# EAGLE design working (EAGLE 9.3.0)
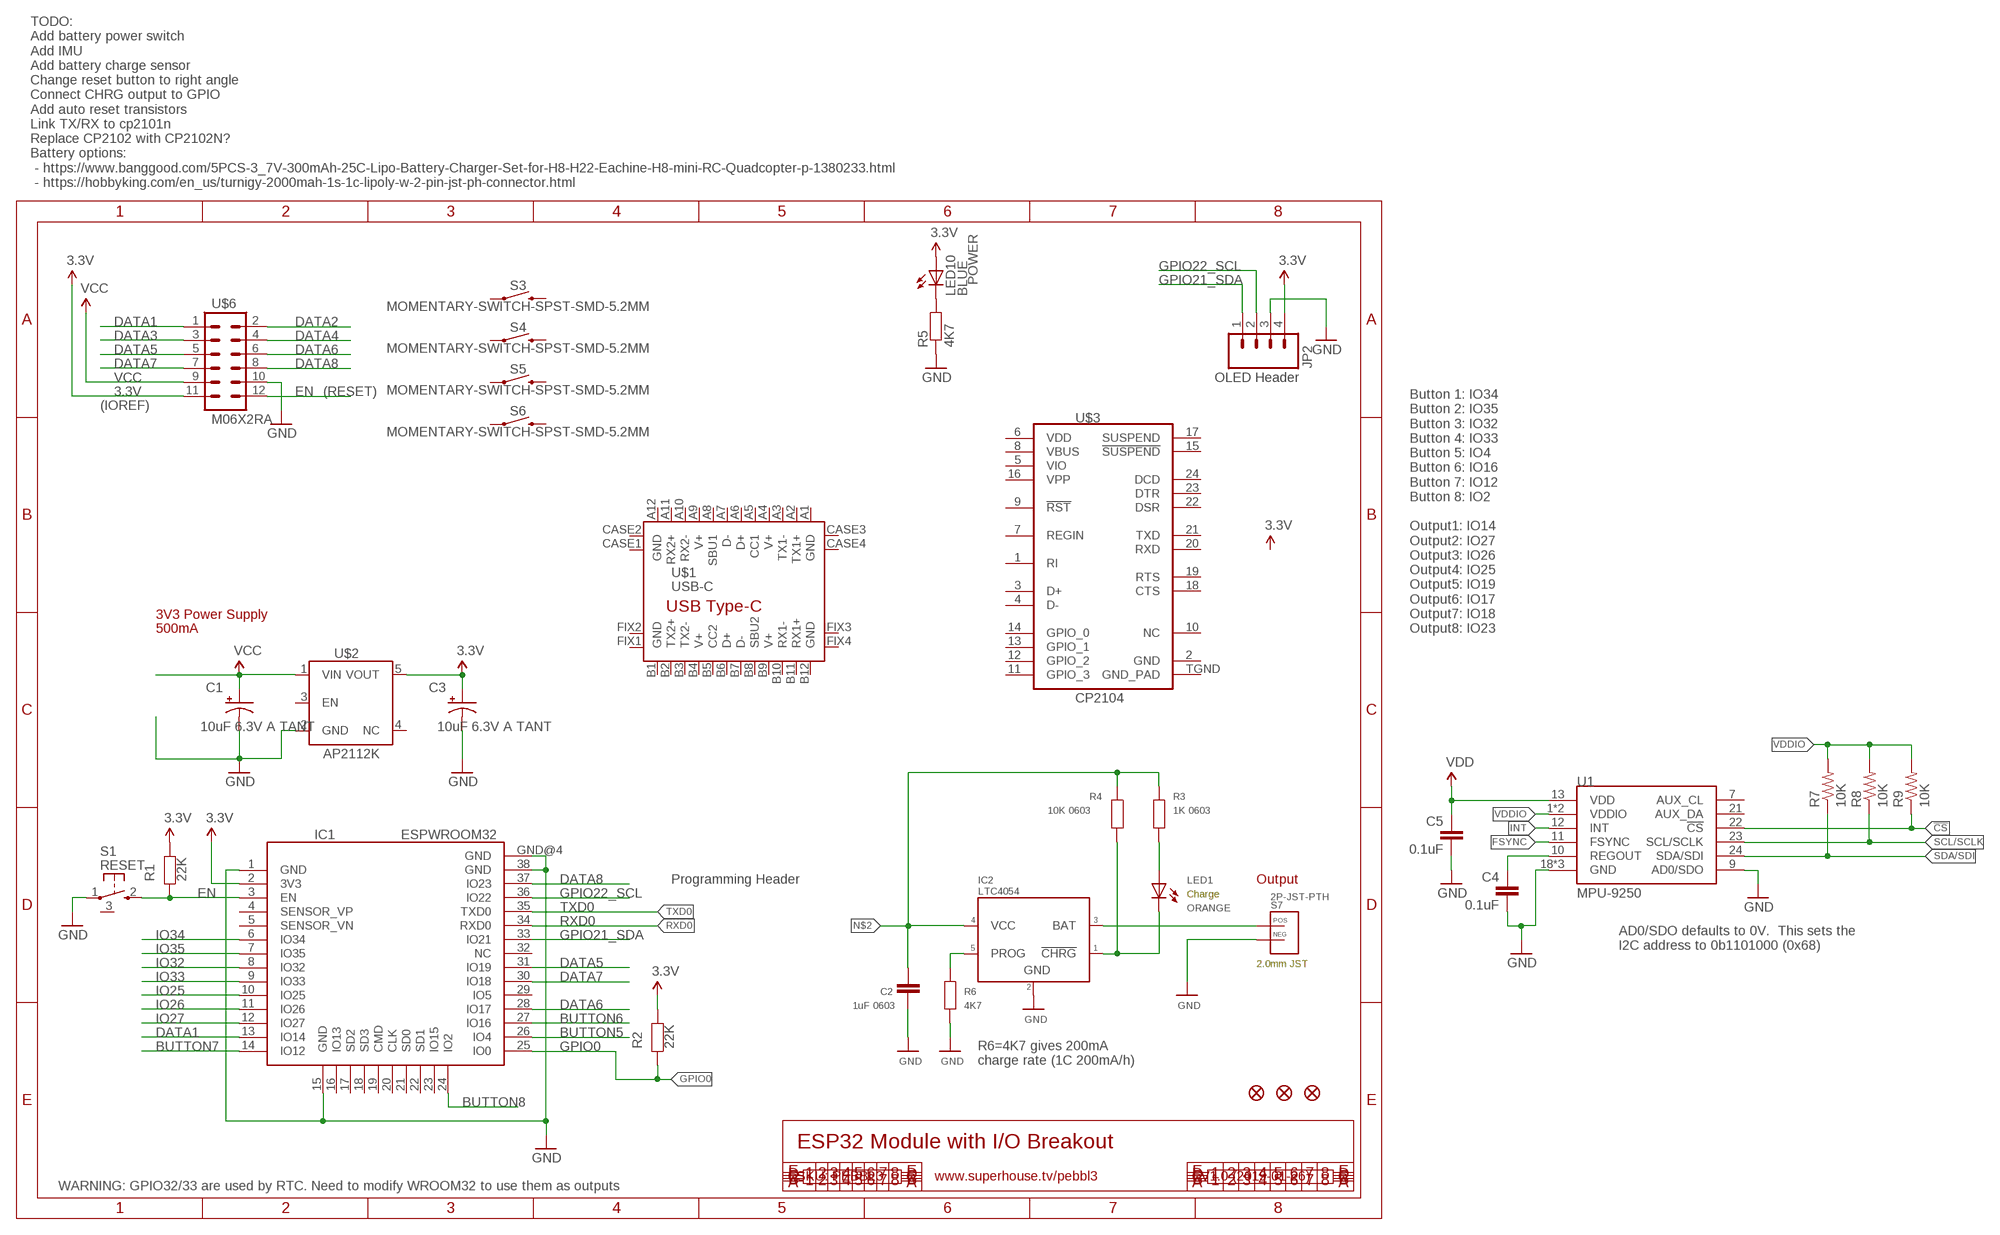
[diagram p0: schematic, sheet 1]

## Parts
C1  10uF 6.3V A TANT  CAP_POL1206  [EIA3216]
C2  1uF 0603  CAP0603  [0603]
C3  10uF 6.3V A TANT  CAP_POL1206  [EIA3216]
C4  0.1uF  0.1UF-25V(+80/-20%)(0603)  [0603-CAP]
C5  0.1uF  0.1UF-25V(+80/-20%)(0603)  [0603-CAP]
FID1  FIDUCIAL1X2.5  [FIDUCIAL-1X2.5]
FID2  FIDUCIAL1X2.5  [FIDUCIAL-1X2.5]
FID3  FIDUCIAL1X2.5  [FIDUCIAL-1X2.5]
IC1  ESPWROOM32  [ESPWROOM32]
IC2  LTC4054  [SOT23-5]
JP2  M04PTH  [1X04]
LED1  ORANGE  LED0603  [LED-0603]
LED10  BLUE  LED0603  [LED-0603]
R1  22K  RESISTOR0603  [0603]
R2  22K  RESISTOR0603  [0603]
R3  1K 0603  RESISTOR0603  [0603]
R4  10K 0603  RESISTOR0603  [0603]
R5  4K7  RESISTOR0603  [0603]
R6  4K7  RESISTOR0603  [0603]
R7  10K  10KOHM-1/10W-1%(0603)0603  [0603-RES]
R8  10K  10KOHM-1/10W-1%(0603)0603  [0603-RES]
R9  10K  10KOHM-1/10W-1%(0603)0603  [0603-RES]
S1  RESET  TAC-SWITCH-1TAB  [TACT-VERT-1TAB]
S3  MOMENTARY-SWITCH-SPST-SMD-5.2MM  [TACTILE_SWITCH_SMD_5.2MM]
S4  MOMENTARY-SWITCH-SPST-SMD-5.2MM  [TACTILE_SWITCH_SMD_5.2MM]
S5  MOMENTARY-SWITCH-SPST-SMD-5.2MM  [TACTILE_SWITCH_SMD_5.2MM]
S6  MOMENTARY-SWITCH-SPST-SMD-5.2MM  [TACTILE_SWITCH_SMD_5.2MM]
S7  2P-JST-PTH  2P-JST-TH-RAPTH  [JST-2MM-TH-RA]
U1  MPU-9250  [QFN24_PAD]
U$1  USB-C  [USB-C-U52A]
U$2  AP2112KSOT25  [SOT23-5]
U$3  CP2104  [QFN-24]
U$6  M06X2RA  [2X6-SHROUDED-RA]

## Nets
3.3V: C3.A(+) IC1.2(3V3) JP2.4 LED10.A R1.1 R2.1 U$2.5(VOUT) U$6.11
!CS: R9.1 U1.22(!CS)
BUTTON5: IC1.26(IO4)
BUTTON6: IC1.27(IO16)
BUTTON7: IC1.14(IO12)
BUTTON8: IC1.24(IO2)
DATA1: IC1.13(IO14) U$6.1
DATA2: U$6.2
DATA3: U$6.3
DATA4: U$6.4
DATA5: IC1.31(IO19) U$6.5
DATA6: IC1.28(IO17) U$6.6
DATA7: IC1.30(IO18) U$6.7
DATA8: IC1.37(IO23) U$6.8
EN: IC1.3(EN) R1.2 S1.2 U$6.12
FSYNC: U1.11(FSYNC)
GND: C1.C(-) C2.1 C3.C(-) C4.2 C5.2 IC1.1(GND) IC1.15(GND) IC1.38(GND) IC1.GND@4(GND) IC2.2(GND) JP2.3 R5.1 R6.2 S1.1 S7.NEG U1.9(AD0/SDO) U1.18(GND) U1.20(GND) U1.CENTER(GND) U$2.2(GND) U$6.10
GPIO0: IC1.25(IO0) R2.2
GPIO21_SDA: IC1.33(IO21) JP2.1
GPIO22_SCL: IC1.36(IO22) JP2.2
INT: U1.12(INT)
IO25: IC1.10(IO25)
IO26: IC1.11(IO26)
IO27: IC1.12(IO27)
IO32: IC1.8(IO32)
IO33: IC1.9(IO33)
IO34: IC1.6(IO34)
IO35: IC1.7(IO35)
N$2: C2.2 IC2.4(VCC) R3.1 R4.1
N$3: IC2.5(PROG) R6.1
N$4: IC2.3(BAT) S7.POS
N$6: IC2.1(!CHRG) LED1.C R4.2
N$8: LED1.A R3.2
N$14: LED10.C R5.2
REGOUT: C4.1 U1.10(REGOUT)
RXD0: IC1.34(RXD0)
SCL/SCLK: R8.1 U1.23(SCL/SCLK)
SDA/SDI: R7.1 U1.24(SDA/SDI)
TXD0: IC1.35(TXD0)
VCC: C1.A(+) U$2.1(VIN) U$6.9
VDD: C5.1 U1.13(VDD)
VDDIO: R7.2 R8.2 R9.2 U1.1(VDDIO) U1.8(VDDIO)
Unconnected: IC1.4(SENSOR_VP) IC1.5(SENSOR_VN) IC1.16(IO13) IC1.17(SD2) IC1.18(SD3) IC1.19(CMD) IC1.20(CLK) IC1.21(SD0) IC1.22(SD1) IC1.23(IO15) IC1.29(IO5) IC1.32(NC) S1.3 S3.1 S3.3 S4.1 S4.3 S5.1 S5.3 S6.1 S6.3 U1.7(AUX_CL) U1.21(AUX_DA) U$1.A2(TX1+) U$1.A3(TX1-) U$1.A5(CC1) U$1.A6(D+) U$1.A7(D-) U$1.A8(SBU1) U$1.A10(RX2-) U$1.A11(RX2+) U$1.B2(TX2+) U$1.B3(TX2-) U$1.B5(CC2) U$1.B6(D+) U$1.B7(D-) U$1.B8(SBU2) U$1.B10(RX1-) U$1.B11(RX1+) U$2.3(EN) U$2.4(NC) U$3.1(RI) U$3.3(D+) U$3.4(D-) U$3.5(VIO) U$3.8(VBUS) U$3.9(!RST) U$3.10(NC) U$3.11(GPIO_3) U$3.12(GPIO_2) U$3.13(GPIO_1) U$3.14(GPIO_0) U$3.15(!SUSPEND) U$3.16(VPP) U$3.17(SUSPEND) U$3.18(CTS) U$3.19(RTS) U$3.20(RXD) U$3.21(TXD) U$3.22(DSR) U$3.23(DTR) U$3.24(DCD)

## Notes on the sheet
- TODO:
  Add battery power switch
  Add IMU
  Add battery charge sensor
  Change reset button to right angle
  Connect CHRG output to GPIO
  Add auto reset transistors
  Link TX/RX to cp2101n
  Replace CP2102 with CP2102N?
  Battery options:
   - https://www.banggood.com/5PCS-3_7V-300mAh-25C-Lipo-Battery-Charger-Set-for-H8-H22-Eachine-H8-mini-RC-Quadcopter-p-1380233.html
   - https://hobbyking.com/en_us/turnigy-2000mah-1s-1c-lipoly-w-2-pin-jst-ph-connector.html
- POWER
- OLED Header
- (RESET)
- (IOREF)
- 3V3 Power Supply
- 500mA
- Button 1: IO34
  Button 2: IO35
  Button 3: IO32
  Button 4: IO33
  Button 5: IO4
  Button 6: IO16
  Button 7: IO12
  Button 8: IO2
  
  Output1: IO14
  Output2: IO27
  Output3: IO26
  Output4: IO25
  Output5: IO19
  Output6: IO17
  Output7: IO18
  Output8: IO23
- Programming Header | Output
- Charge
- AD0/SDO defaults to 0V.  This sets the
  I2C address to 0b1101000 (0x68)
- 2.0mm JST
- R6=4K7 gives 200mA
  charge rate (1C 200mA/h)
- ESP32 Module with I/O Breakout
- SKU: PEBBL3 | www.superhouse.tv/pebbl3 | V1.0 (2019-01-26)
- WARNING: GPIO32/33 are used by RTC. Need to modify WROOM32 to use them as outputs

## Power pins joined to a net without a drawn wire
GND: U$1.A1(GND) U$1.A12(GND) U$1.B1(GND) U$1.B12(GND) U$1.CASE1(GND) U$1.CASE2(GND) U$1.CASE3(GND) U$1.CASE4(GND) U$1.FIX1(GND) U$1.FIX2(GND) U$1.FIX3(GND) U$1.FIX4(GND) U$3.2(GND)
GND_PAD: U$3.TGND(GND_PAD)
REGIN: U$3.7(REGIN)
V+: U$1.A4(V+) U$1.A9(V+) U$1.B4(V+) U$1.B9(V+)
VDD: U$3.6(VDD)

## Library data of the parts
C1 C3 = freetronics:CAP_POL: Capacitor Polarized These are standard SMD and PTH capacitors. Normally 10uF, 47uF, and 100uF in electrolytic and tantalum varieties. Always verify the external diameter of the through hole cap, it varies with capacity, voltage, and manufacturer. The EIA devices should be standard.
C2 = freetronics:CAP: Capacitor Standard 0603 ceramic capacitor, and 0.1" leaded capacitor.
C4 C5 = SparkFun-Capacitors:0.1UF-25V(+80/-20%)(0603): CAP-00810 Ceramic Standard decoupling cap; PROD_ID: CAP-00810
FID1-FID3 = freetronics:FIDUCIAL: Fiducial Alignment Points Various fiducial points for machine vision alignment.
IC1 = freetronics-jon:ESPWROOM32
IC2 = freetronics-luke:LTC4054: Linear Technologies LTC4054 Li-ion battery charger in SOT23-5. (Or equivalent device.) http://cds.linear.com/docs/Datasheet/405442xf.pdf
JP2 = freetronics-jon:M04: Header 4 Standard 4-pin 0.1" header. Use with straight break away headers (SKU : PRT-00116), right angle break away headers (PRT-00553), swiss pins (PRT-00743), machine pins (PRT-00117), and female headers (PRT-00115). Molex polarized connector foot print use with SKU : PRT-08231 with associated crimp pins and housings. 1MM SMD Version SKU: PRT-10208
LED1 = freetronics-master-v1:LED: LEDs Standard schematic elements and footprints for 5mm, 3mm, 1206, and 0603 sized LEDs. 5mm - Spark Fun Electronics SKU : COM-00529 (and others)
LED10 = freetronics-jon:LED: LEDs Standard schematic elements and footprints for 5mm, 3mm, 1206, and 0603 sized LEDs. 5mm - Spark Fun Electronics SKU : COM-00529 (and others)
R1-R4 R6 = freetronics:RESISTOR: Resistor Basic schematic elements and footprints for 0603, 1206, and PTH 1/10th watt (small) resistors.
R5 = freetronics-jon:RESISTOR: Resistor Basic schematic elements and footprints for 0603, 1206, and PTH 1/10th watt (small) resistors.
R7-R9 = SparkFun-Resistors:10KOHM-1/10W-1%(0603): RES-00824; PROD_ID: RES-00824
S1 = freetronics-jon:TAC-SWITCH-1TAB
S3-S6 = SparkFun-Switches:MOMENTARY-SWITCH-SPST: Momentary Switch (Pushbutton) - SPST Normally-open (NO) SPST momentary switches (buttons, pushbuttons). Variants PTH-12MM - 12mm square, through-hole Momentary Pushbutton Switch - 12mm Square <https://www.sparkfun.com/products/9190> (COM-09190) PTH-6.0MM, PTH-6.0MM-KIT - 6.0mm square, through-hole Mini Pushbutton Switch <https://www.sparkfun.com/products/97> (COM-00097) KIT package intended for soldering kit's - only one side of pads' copper is exposed. PTH-RIGHT-ANGLE-KIT - Right-angle, through-hole Right Angle Tactile Button <https://www.sparkfun.com/products/10791> - Used on SparkFun BigTime Watch Kit <https://www.sparkfun.com/products/11734> SMD-12MM - 12mm square, surface-mount Tactile Button - SMD (12mm) <https://www.sparkfun.com/products/12993> (COM-12993) Used on SparkFun PicoBoard <https://www.sparkfun.com/products/11888> SMD-4.5MM - 4.5mm Square Trackball Switch Used on SparkFun Blackberry Trackballer Breakout <https://www.sparkfun.com/products/13169> SMD-4.6MMX2.8MM - 4.60mm x 2.80mm, surface mount Used on SparkFun SAMD21 Mini Breakout <https://www.sparkfun.com/products/13664> SMD-5.2MM, SMD-5.2-REDUNDANT - 5.2mm square, surface-mount Mini Pushbutton Switch - SMD <https://www.sparkfun.com/products/8720> (COM-08720) Used on Arduino Pro Mini <https://www.sparkfun.com/products/11114> REDUNDANT package connects both switch circuits together SMD-6.0X3.5MM - 6.0 x 3.5mm, surface mount Momentary Reset Switch SMD <https://www.sparkfun.com/products/8229> (COM-08229) SMD-6.2MM-TALL - 6.2mm square, surface mount Tactile Button - SMD (6mm) <https://www.sparkfun.com/products/12992> Used on SparkFun Digital Sandbox <https://www.sparkfun.com/products/12651> SMD-RIGHT-ANGLE - Right-angle, surface mount Used on SparkFun Block for Intel® Edison - Arduino <https://www.sparkfun.com/products/13036>; PROD_ID: SWCH-08247; SF_SKU: COM-08720
S7 = freetronics-jon:2P-JST-TH-RA: 2.0 mm pitch, through-hole 2-pin right-angle JST header, suitable for small Li-po batteries.
U1 = Testing:MPU-9250: NC pin 19. 2-6 & 14-17 not internally connected. May be used for PCB trace routing.; PROD_ID: IC-13192
U$1 = freetronics-jon:USB-C
U$2 = freetronics-jon:AP2112K: AP2112K LDO linear voltage regulator
U$3 = freetronics-jon:CP2104
U$6 = freetronics-jon:M06X2

## Net classes
0 Default: width 0.203 mm
1 VCC: width 0.305 mm

## Board
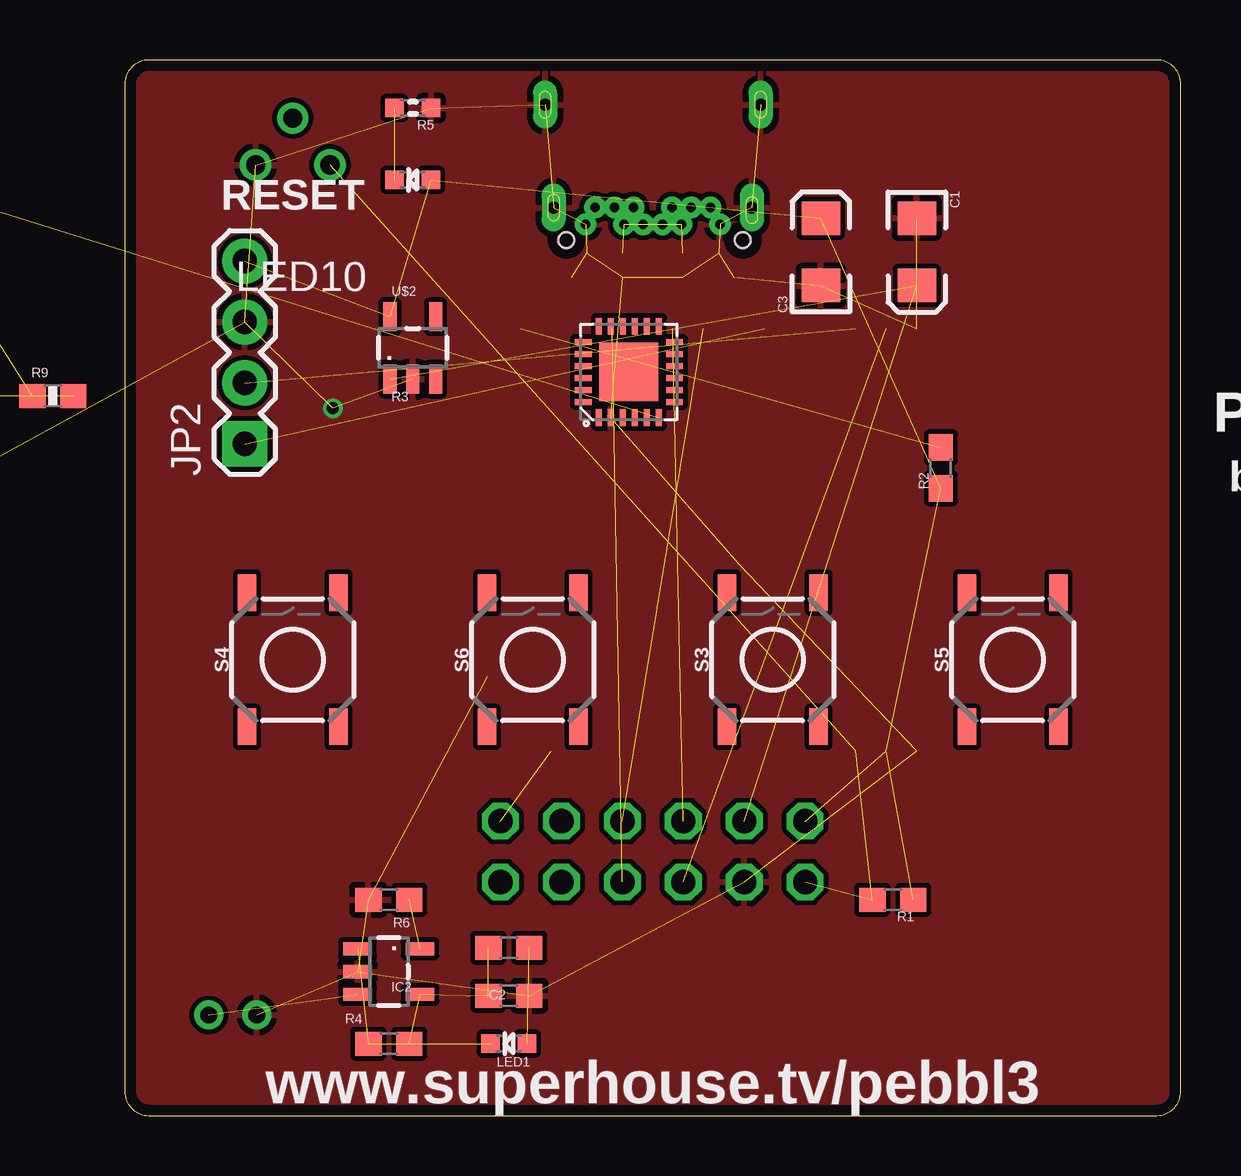
[diagram p1: board, top side]
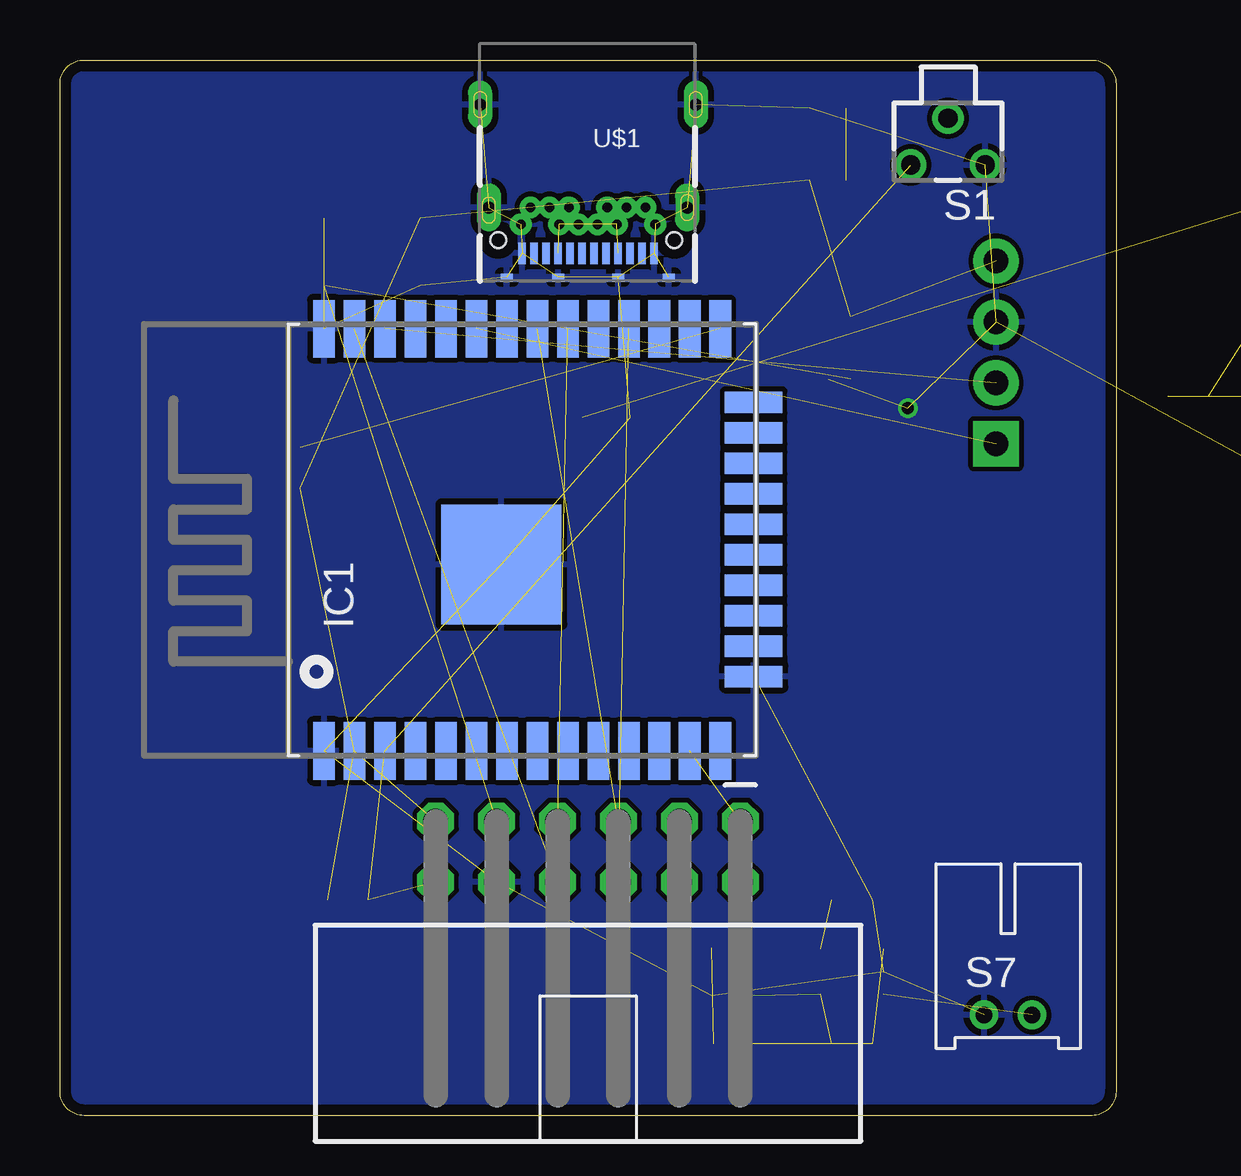
[diagram p2: board, bottom side, seen from below]

Size 44 x 44 mm. Coordinates in mm from the lower left corner, seen from the top.
Outline: 43,44 1,44 arc90 0,43 0,1 arc90 1,0 43,0 arc90 44,1 44,43 arc90 43,44
Copper layers (1*16): Top 0.035mm / dielectric 1.5mm / Bottom 0.035mm
Design rules "default": minimum track width 8mil, minimum drill 15mil, track to track 8mil, track to pad 8mil, pad to pad 8mil, via to via 8mil, smd to smd 8mil, copper to edge 18mil, drill to drill 8mil, minimum pad ring 10mil, minimum via ring 6mil, stop-mask expansion 4mil, vias tented up to drill 25mil, thermal gap 10mil
tRestrict: area 58,29 to 60,31; area 47.5,41 to 49.5,43; area 49,34 to 51,36

### Footprints (pad centres in the part's own frame; a part is rotated, then mirrored left to right if it is on the bottom)
EIA3216 = smd 1.4 x 1.6: A 1.4,0; C -1.4,0
0603 = smd 1.1 x 1: 1 -0.85,0; 2 0.85,0
0603-CAP = smd 1.1 x 1: 1 -0.85,0; 2 0.85,0
FIDUCIAL-1X2.5 = smd 1 x 1: 1 0,0
ESPWROOM32 = smd 2.4 x 0.9: 1 -8.8,-1.5; 2 -8.8,-2.77; 3 -8.8,-4.04; 4 -8.8,-5.31; 5 -8.8,-6.58; 6 -8.8,-7.85; 7 -8.8,-9.12; 8 -8.8,-10.39; 9 -8.8,-11.66; 10 -8.8,-12.93; 11 -8.8,-14.2; 12 -8.8,-15.47; 13 -8.8,-16.74; 14 -8.8,-18.01; 25 8.8,-18.01; 26 8.8,-16.74; 27 8.8,-15.47; 28 8.8,-14.2; 29 8.8,-12.93; 30 8.8,-11.66; 31 8.8,-10.39; 32 8.8,-9.12; 33 8.8,-7.85; 34 8.8,-6.58; 35 8.8,-5.31; 36 8.8,-4.04; 37 8.8,-2.77; 38 8.8,-1.5 | smd 0.9 x 2.4: 15 -5.7,-19.4; 16 -4.43,-19.4; 17 -3.16,-19.4; 18 -1.89,-19.4; 19 -0.62,-19.4; 20 0.65,-19.4; 21 1.92,-19.4; 22 3.19,-19.4; 23 4.46,-19.4; 24 5.73,-19.4 | smd 5 x 5: GND@4 -1.03,-8.89
SOT23-5 = smd 0.55 x 1.2: 1 -0.95,-1.3; 2 0,-1.3; 3 0.95,-1.3; 4 0.95,1.3; 5 -0.95,1.3
1X04 = drill 1.016 pad 1.88 square: 1 0,0 | drill 1.016 pad 1.88: 2 2.54,0; 3 5.08,0; 4 7.62,0
LED-0603 = smd 0.762 x 0.762: A -0.762,0; C 0.762,0
0603' = smd 0.762 x 0.762: 1 -0.762,0; 2 0.762,0
0603-RES = smd 1.1 x 1: 1 -0.85,0; 2 0.85,0
TACT-VERT-1TAB = drill 0.8: 1 -1.55,0.975; 2 1.55,0.975; 3 0,-0.975
TACTILE_SWITCH_SMD_5.2MM = smd 1.524 x 0.762: 1 -2.794,1.905; 2 2.794,1.905; 3 -2.794,-1.905; 4 2.794,-1.905
JST-2MM-TH-RA = drill 0.7: NEG -1,-3.81; POS 1,-3.81
QFN24_PAD = smd 0.5 x 0.25: 1 -1.55,1; 2 -1.55,0.6; 3 -1.55,0.2; 4 -1.55,-0.2; 5 -1.55,-0.6; 6 -1.55,-1; 13 1.55,-1; 14 1.55,-0.6; 15 1.55,-0.2; 16 1.55,0.2; 17 1.55,0.6; 18 1.55,1 | smd 0.08 x 0.13: 1$1 -1.32,1.06; 1$3 -1.26,0.94; P$33 1.26,-0.94; P$34 1.32,-1.06; P$58 1.26,0.94; P$59 1.32,1.06; P$68 -1.26,-0.94; P$69 -1.32,-1.06 | smd 0.1 x 0.185 rotated 45: 1$2 -1.25,1.024; P$49 1.024,-1.25 | smd 0.14 x 0.14: 1$4 -1.22,0.945; P$23 -0.945,-1.22; P$24 1.22,-0.945; P$36 0.945,1.22; P$51 0.945,-1.22; P$56 1.22,0.945; P$61 -0.945,1.22; P$66 -1.22,-0.945 | smd 0.05 x 0.05: 1$5 -1.175,0.97; P$25 -0.97,-1.175; P$31 1.175,-0.97; P$37 0.97,1.175; P$52 0.97,-1.175; P$57 1.175,0.97; P$62 -0.97,1.175; P$67 -1.175,-0.97 | smd 0.25 x 0.5: 7 -1,-1.55; 8 -0.6,-1.55; 9 -0.2,-1.55; 10 0.2,-1.55; 11 0.6,-1.55; 12 1,-1.55; 19 1,1.55; 20 0.6,1.55; 21 0.2,1.55; 22 -0.2,1.55; 23 -0.6,1.55; 24 -1,1.55 | smd 0.25 x 0.25: CENTER 0,0 | smd 0.4 x 0.4: DBBADFE -0.675,0.24 | smd 0.6 x 1.2: DBBADFE1 -0.575,-0.195 | smd 0.25 x 0.3: P$1 -0.2,1.3; P$3 0.2,1.3; P$5 0.6,1.3; P$11 -0.6,1.3; P$16 0.2,-1.3; P$18 -0.2,-1.3; P$20 -0.6,-1.3; P$26 0.6,-1.3 | smd 0.3 x 0.25: P$2 -1.3,0.2; P$4 -1.3,0.6; P$28 -1.3,-0.2; P$38 -1.3,-0.6; P$40 1.3,0.2; P$42 1.3,-0.2; P$44 1.3,-0.6; P$50 1.3,0.6 | smd 0.1 x 0.185 rotated 225: P$7 1.25,-1.024; P$60 -1.024,1.25 | smd 1.1 x 1.59: P$13 0.325,0 | smd 0.3 x 0.5 rotated 315: P$14 -0.592,0.512 | smd 0.5 x 1.59: P$15 -0.27,0 | smd 0.1 x 0.185 rotated 135: P$22 -1.024,-1.25; P$55 1.25,1.024 | smd 0.13 x 0.08: P$27 -0.94,-1.26; P$29 -1.06,-1.32; P$39 0.94,1.26; P$41 1.06,1.32; P$53 0.94,-1.26; P$54 1.06,-1.32; P$63 -0.94,1.26; P$64 -1.06,1.32 | smd 0.1 x 0.185 rotated 315: P$35 1.024,1.25; P$65 -1.25,-1.024
USB-C-U52A = smd 0.3 x 0.9: A1 0.85,0.56; A2 1.35,0.56; A3 1.85,0.56; A4 2.35,0.56; A5 2.85,0.56; A6 3.35,0.56; A7 3.85,0.56; A8 4.35,0.56; A9 4.85,0.56; A10 5.35,0.56; A11 5.85,0.56; A12 6.35,0.56 | drill 0.4 pad 0.6: B1 6.4,-0.65; B2 6,-1.35; B3 5.2,-1.35; B4 4.8,-0.65; B5 4.4,-1.35; B6 4,-0.65; B7 3.2,-0.65; B8 2.8,-1.35; B9 2.4,-0.65; B10 2,-1.35; B11 1.2,-1.35; B12 0.8,-0.65 | smd 0.5 x 0.3: CASE1 0.23,1.55; CASE2 2.35,1.55; CASE3 4.85,1.55; CASE4 6.98,1.55 | drill 0.5 pad 0.7 long: FIX1 -0.89,-5.64; FIX2 -0.53,-1.35; FIX3 7.73,-1.35; FIX4 8.09,-5.64 | hole 0.65: 7.35,0; 0,0
QFN-24 = smd 0.25 x 0.7: 1 -1.25,-1.9; 2 -0.75,-1.9; 3 -0.25,-1.9; 4 0.25,-1.9; 5 0.75,-1.9; 6 1.25,-1.9; 13 1.25,1.9; 14 0.75,1.9; 15 0.25,1.9; 16 -0.25,1.9; 17 -0.75,1.9; 18 -1.25,1.9 | smd 0.7 x 0.25: 7 1.9,-1.25; 8 1.9,-0.75; 9 1.9,-0.25; 10 1.9,0.25; 11 1.9,0.75; 12 1.9,1.25; 19 -1.9,1.25; 20 -1.9,0.75; 21 -1.9,0.25; 22 -1.9,-0.25; 23 -1.9,-0.75; 24 -1.9,-1.25 | smd 2.45 x 2.45: TGND 0,0
2X6-SHROUDED-RA = drill 1.016 octagon: 1 6.35,1.27; 2 6.35,-1.27; 3 3.81,1.27; 4 3.81,-1.27; 5 1.27,1.27; 6 1.27,-1.27; 7 -1.27,1.27; 8 -1.27,-1.27; 9 -3.81,1.27; 10 -3.81,-1.27; 11 -6.35,1.27; 12 -6.35,-1.27

### Placement (x,y rotation side)
C1  33,36 270 top
C2  16,5 180 top
C3  29,36 90 top
C4  -11,27 0 top  (outside the outline)
C5  -7,27 0 top  (outside the outline)
FID1  59,30 180 top  (outside the outline)
FID2  48.5,42 180 top  (outside the outline)
FID3  50,35 180 top  (outside the outline)
IC1  34.5,24 90 bottom
IC2  11,6 270 top
JP2  5,28 90 top
LED1  16,3 180 top
LED10  12,39 180 top
R1  32,9 180 top
R2  34,27 90 top
R3  16,7 0 top
R4  11,3 180 top
R5  4K7  [0603']  12,42 180 top
R6  11,9 180 top
R7  -7,30 0 top  (outside the outline)
R8  -11,30 0 top  (outside the outline)
R9  -3,30 0 top
S1  7,40.6 180 bottom
S3  27,19 90 top
S4  7,19 90 top
S5  37,19 90 top
S6  17,19 90 top
S7  4.5,8 0 bottom
U1  -11,40 0 top  (outside the outline)
U$1  18.4,36.5 180 bottom
U$2  12,32 0 top
U$3  21,31 0 top
U$6  22,11 0 bottom

### Tracks (layer width: path | path; a pad name or v marks a point on that pad's centre or on a via)
3.3V  (7 unrouted)
!CS  (1 unrouted)
DATA1  (1 unrouted)
DATA5  (1 unrouted)
DATA6  (1 unrouted)
DATA7  (1 unrouted)
DATA8  (1 unrouted)
EN  (3 unrouted)
GND  (via drill 0.5)  (34 unrouted)
  other vias: 8.67,29.48
  pour Bottom: 43,0 1,0 arc-90 0,1 0,43 arc-90 1,44 43,44 arc-90 44,43 44,1 arc-90
  pour Top: 43,0 1,0 arc-90 0,1 0,43 arc-90 1,44 43,44 arc-90 44,43 44,1 arc-90
GPIO0  (1 unrouted)
GPIO21_SDA  (1 unrouted)
GPIO22_SCL  (1 unrouted)
N$2  (3 unrouted)
N$3  (1 unrouted)
N$4  (1 unrouted)
N$6  (2 unrouted)
N$8  (1 unrouted)
N$14  (1 unrouted)
REGOUT  (1 unrouted)
SCL/SCLK  (1 unrouted)
SDA/SDI  (1 unrouted)
V+  (3 unrouted)
VCC  (2 unrouted)
VDD  (2 unrouted)
VDDIO  (4 unrouted)

### Text on the board
tPlace: RESET | PEBBL3 | by Jonathan Oxer | v1.0 | (C)2018 SuperHouse Automation P/L | www.superhouse.tv/pebbl3